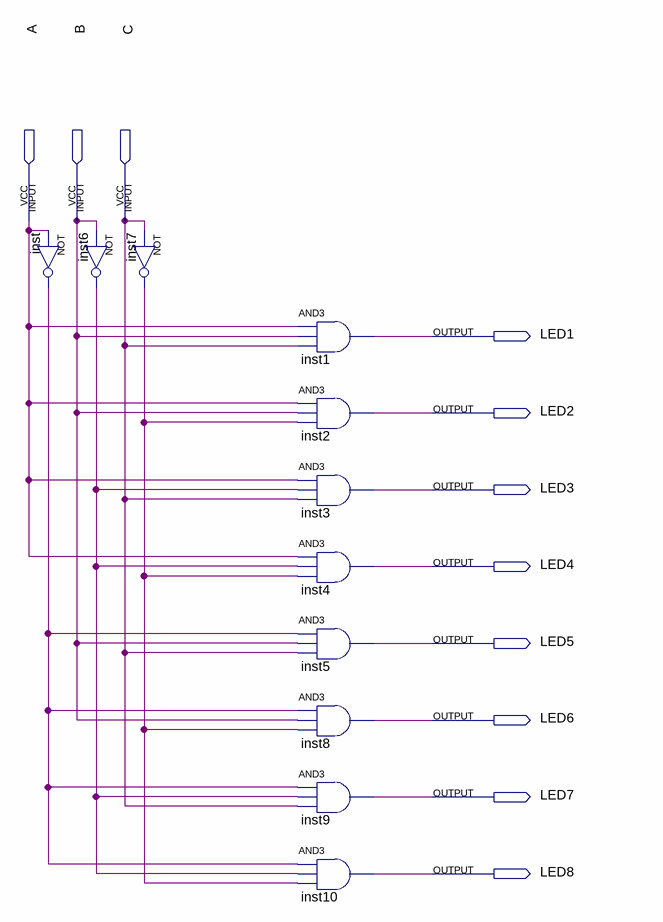
[diagram p0: schematic sheet]
// Quartus schematic ContagemDaMemoria.bdf as structural Verilog: 11 symbols, 11 pins
module ContagemDaMemoria (
  input  A,
  input  B,
  input  C,
  output LED1,
  output LED2,
  output LED3,
  output LED4,
  output LED5,
  output LED6,
  output LED7,
  output LED8
);

  wire inst6_out, inst7_out, inst_out;

  not inst (inst_out, A);
  not inst6 (inst6_out, B);
  not inst7 (inst7_out, C);
  and inst1 (LED1, A, B, C);
  and inst2 (LED2, A, B, inst7_out);
  and inst3 (LED3, A, inst6_out, C);
  and inst4 (LED4, A, inst6_out, inst7_out);
  and inst5 (LED5, inst_out, B, C);
  and inst8 (LED6, inst_out, B, inst7_out);
  and inst9 (LED7, inst_out, inst6_out, C);
  and inst10 (LED8, inst_out, inst6_out, inst7_out);
endmodule
